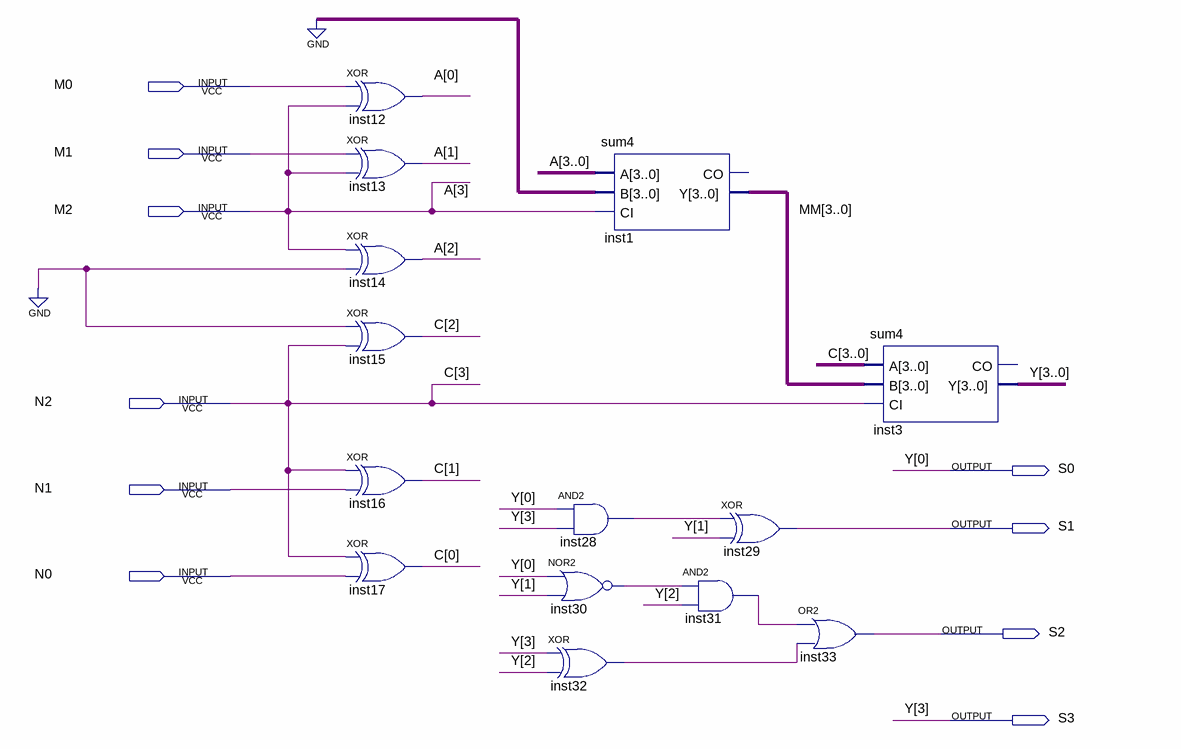
[diagram p0: schematic sheet]
// Quartus schematic calculator.bdf as structural Verilog: 14 symbols, 10 pins
module calculator (
  input  M0,
  input  M1,
  input  M2,
  input  N2,
  input  N1,
  input  N0,
  output S0,
  output S1,
  output S2,
  output S3
);

  wire inst28_out, inst30_out, inst31_out, inst32_out;
  wire [2:0] A, C;
  wire [2:1] Y;
  wire [3:0] MM;

  xor inst12 (A[0], M0, M2);
  xor inst13 (A[1], M1, M2);
  xor inst14 (A[2], M2, 1'b0);
  xor inst15 (C[2], 1'b0, N2);
  xor inst16 (C[1], N2, N1);
  xor inst17 (C[0], N2, N0);
  sum4 inst1 (.A({M2, A}), .B(4'b0000), .CI(M2), .Y(MM));  // open: CO
  and inst28 (inst28_out, S0, S3);
  nor inst30 (inst30_out, S0, Y[1]);
  xor inst32 (inst32_out, S3, Y[2]);
  xor inst29 (S1, inst28_out, Y[1]);
  and inst31 (inst31_out, inst30_out, Y[2]);
  or inst33 (S2, inst31_out, inst32_out);
  sum4 inst3 (.A({N2, C}), .B(MM), .CI(N2), .Y({S3, Y, S0}));  // open: CO

  // Other names for the same wires on the sheet: A[3] = M2; C[3] = N2; Y (some bits) = {S3, S0}
endmodule
